# Altium schematic sheet AudioAmp.SchDoc: TEAM JX Simon
size 431 x 279 mm; Date: 02/16/2021; ApprovedBy: Jiahong JI; CheckedBy: Jiahong JI; Author: Chengyang Xi; CompanyName: Chengyang Xi; DrawnBy: Chengyang Xi; Engineer: Chengyang Xi; Organization: UPenn
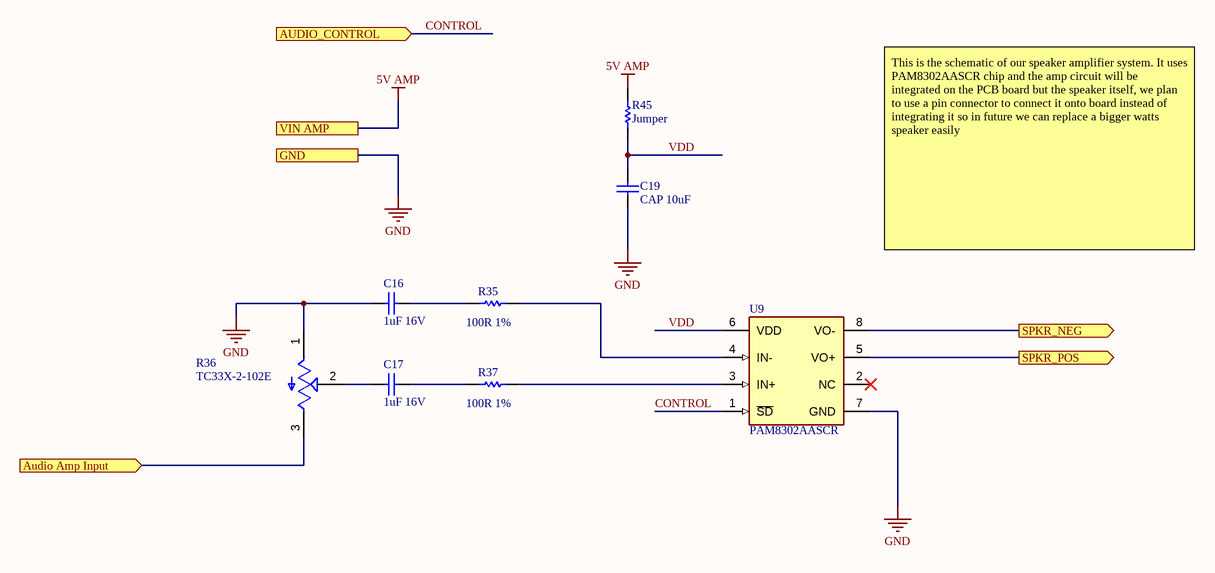
[diagram p0: AudioAmp.SchDoc]

## Parts
C16  1uF 16V  [CAPC0603(1608)100_N]
C17  1uF 16V  [CAPC0603(1608)100_N]
C19  CAP 10uF  [CAPC0805(2012)145_N]
R35  100R 1%  [RESC0603(1608)_M]
R36  TC33X-2-102E  [TRIM_TC33X-2-102E]
R37  100R 1%  [RESC0603(1608)_M]
R45  Jumper  [RESC0603(1608)_N]
U9  PAM8302AASCR  [FP-MSOP-8-MFG]

## Ports
Audio Amp Input (in), AUDIO_CONTROL (in), GND, SPKR_NEG (out), SPKR_POS (out), VIN AMP

## Nets
5V AMP: R45.2 ; port VIN AMP
GND: C16.2 C19.1 R36.1(CCW) U9.7(GND) ; port GND
Audio Amp Input: R36.3(CW) ; port Audio Amp Input
CONTROL: U9.1(~{SD}) ; port AUDIO_CONTROL
SPKR_NEG: U9.8(VO-) ; port SPKR_NEG
SPKR_POS: U9.5(VO+) ; port SPKR_POS
VDD: C19.2 R45.1 U9.6(VDD)
NetC16_1: C16.1 R35.1
NetC17_1: C17.1 R37.1
NetC17_2: C17.2 R36.2(W)
NetR35_2: R35.2 U9.4(IN-)
NetR37_2: R37.2 U9.3(IN+)

Not connected (* = marked no-connect by the designer): U9 2(NC)*

## Notes on the sheet
- This is the schematic of our speaker amplifier system. It uses PAM8302AASCR chip and the amp circuit will be integrated on the PCB board but the speaker itself, we plan to use a pin connector to connect it onto board instead of integrating it so in future we can replace a bigger watts speaker easily
- DWG. NO.
- REV.
- SHT.
- THIS DOCUMENT AND THE DATA DISCLOSED HEREIN OR HEREWITH IS THE PROPERTY OF ALTIUM LIMITED AND MAY BE FREELY DISTRIBUTED IN WHOLE. NO RIGHTS ARE RESERVED OR EXPRESS OR IMPLIED WARANTEE GIVEN.
- REVISION
- DESCRIPTION
- DATE
- APPROVED
- ENG:
- APPROVALS
- PROJECT
- DSN:
- CHK:
- REFERENCE DOCUMENTS
- PROJECT REVISION:
- TITLE
- DOCUMENT REVISION:
- DESIGN ITEM:
- BOM:
- FAB DWG:
- PCB DWG:
- ASSY DWG:
- SCALE:
- SIZE
- B
- CAGE CODE
- FILE NAME
- DWG NO.
- SHEET
- OF
- REV

## Library data of the parts
C16 C17 = CMP-1035-02736-1: CAP 1uF 16V ±5% 0603 (1608 Metric) Thickness 1mm SMD; Case-Metric: 1608; Case-EIA: 0603; Tolerance: Â±5%; Technology: SMT; Max Thickness: 1 mm; Rated Voltage: 16 V; Value: 1uF
C19 = CMP-1036-04927-1: CAP 10uF 16V ±10% 0805 (2012 Metric) Thickness 1.45mm SMD; Case-EIA: 0805; Tolerance: Â±10%; Case-Metric: 2012; Rated Voltage: 16 V; Technology: SMT; Value: 10uF; Max Thickness: 1.45 mm
R35 R37 = CMP-1012-00397-1: 100R 0.1W 1% 0603 (1608 Metric)  SMD; Value: 100.00 Ohm; Case-EIA: 0603; Case-Metric: 1608; Technology: SMT; Tolerance: 1 %; Power: 0.1 W
R36 = TC33X-2-102E: 1 kOhms 0.1W, 1/10W J Lead Surface Mount Trimmer Potentiometer Cermet 1 Turn Top Adjustment; MF: Bourns; Purchase-URL: https://pricing.snapeda.com/search/part/TC33X-2-102E/?ref=eda; Digi-Key_Part_Number: TC33X-102ECT-ND; Check_prices: https://www.snapeda.com/parts/TC33X-2-102E/Bourns/view-part/421910/?ref=eda; Value: *; Package: 1608 Bourns; MP: TC33X-2-102E; SnapEDA_Link: https://www.snapeda.com/parts/TC33X-2-102E/Bourns/view-part/421910/?ref=snap
R45 = CMP-1012-00001-1: Jumper 0603 (1608 Metric); Case-Metric: 1608; Value: 0.00 Ohm; Power: None; Case-EIA: 0603; Technology: SMT; Tolerance: None
U9 = CMP-12733-000002-1: IC AMP CLASS D MONO 2.5W 8MSOP; Manufacturer: Diodes Inc.; Nominal Supply Current: 4mA; Number Of Channels: 1; Max Junction Temp: +125°C; Min Supply Voltage: 2V; Power At Speaker R: 2.5W @ 4Ω; Max Supply Voltage: 5.5V; Voltage Gain: 24dB; Standoff Height: 0.05mm; Manufacturer Part Number: PAM8302AASCR; ComponentLink2URL: https://www.diodes.com/assets/Datasheets/PAM8302A.pdf; Mouser Description: Audio Amplifiers 2.5W MONO FILTERLESS CLASS-D AUDIO AMP; ComponentLink2Description: Datasheet; Temperature: -40°C to +85°C; Automotive: No; Footprint Url: https://www.diodes.com/assets/Package-Files/MSOP-8.pdf; Device Class L1: Integrated Circuits (ICs); Temperature Range Low: -40°C; Temperature Range High: +85°C; Lead Free: Yes; Package: MSOP-8; Height: 1.1mm; Category: IC; Ipc Land Pattern Name: SOP65P490X110-8; Octopart: https://octopart.com/pam8302aascr-diodes+inc.-29030473; RoHS: TRUE; Device Class L3: Amplifiers - Audio; Device Class L2: Linear ICs; Digikey Description: IC AMP CLASS D MONO 2.5W 8MSOP